# EAGLE design ESP_DCF77_Emulator (EAGLE 9.6.2)
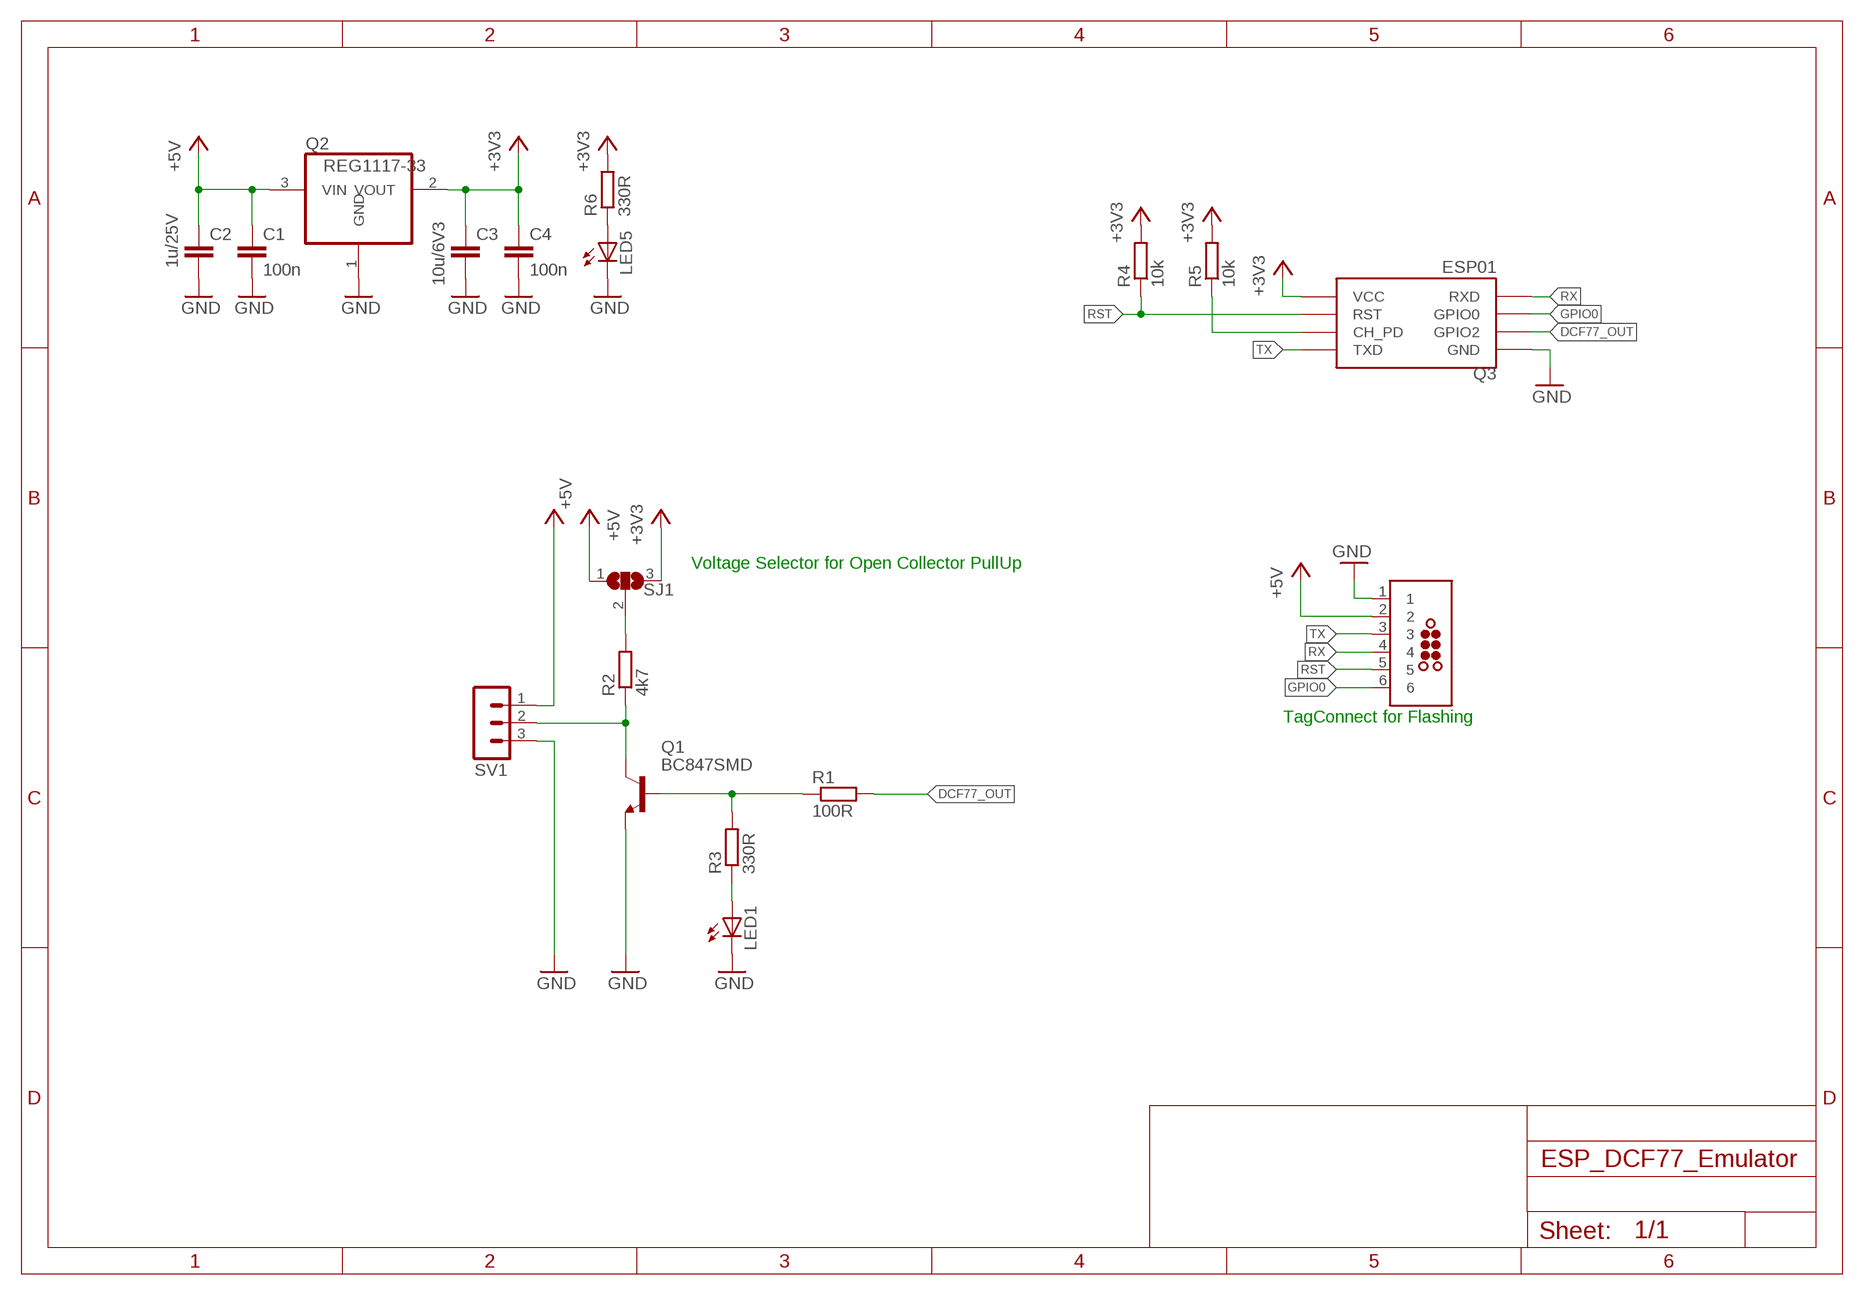
[diagram p0: schematic, sheet 1]

## Parts
C1  100n  C-EUC0603  [C0603]
C2  1u/25V  C-EUC0603  [C0603]
C3  10u/6V3  C-EUC0603  [C0603]
C4  100n  C-EUC0603  [C0603]
J6  TC2030-MCP-NL  [TC2030-MCP-NL]
LED1  LEDCHIP-LED0603  [CHIP-LED0603]
LED5  LEDCHIP-LED0603  [CHIP-LED0603]
Q1  BC847SMD  [SOT23]
Q2  REG1117-33  REG1117  [SOT223]
Q3  ESP01  [ESP01]
R1  100R  R-EU_R0603  [R0603]
R2  4k7  R-EU_R0603  [R0603]
R3  330R  R-EU_R0603  [R0603]
R4  10k  R-EU_R0603  [R0603]
R5  10k  R-EU_R0603  [R0603]
R6  330R  R-EU_R0603  [R0603]
SJ1  SJ2W  [SJ_2]
SV1  MA03-1  [MA03-1]

## Nets
+3V3: C3.1 C4.1 Q2.2(VOUT) Q3.VCC R4.2 R5.2 R6.2 SJ1.3
+5V: C1.1 C2.1 J6.2 Q2.3(VIN) SJ1.1 SV1.1
DCF77_OUT: Q3.GPIO2 R1.2
GND: C1.2 C2.2 C3.2 C4.2 J6.1 LED1.C LED5.C Q1.2(E) Q2.1(GND) Q3.GND SV1.3
GPIO0: J6.6 Q3.GPIO0
N$1: Q1.3(C) R2.1 SV1.2
N$2: Q1.1(B) R1.1 R3.2
N$3: R2.2 SJ1.2
N$4: LED1.A R3.1
N$7: Q3.CH_PD R5.1
N$13: LED5.A R6.1
RST: J6.5 Q3.RST R4.1
RX: J6.4 Q3.RX(RXD)
TX: J6.3 Q3.TX(TXD)

## Notes on the sheet
- Voltage Selector for Open Collector PullUp
- TagConnect for Flashing

## Library data of the parts
C1-C4 = rcl:C-EU: CAPACITOR, European symbol
J6 = tag-connect:TC2030: TAG-CONNECT ICSP Connector Manufacturer: Tag-Connect <http://www.tag-connect.com> Cable for easy In-Circuit Serial Programming. Designed for Microchip ICD2, suitable for many others. Two variants - one "with legs" (for hands-free fit on PCB) and another "without legs" for quick programming. PAD Description 1 MCLR/Vpp 2 Vdd 3 GND 4 PGD (ISPDAT) 5 PGC (ISPCLK) 6 nc (used for LVP) ©2009 ROFA.cz - modified and updated by Robert Darlington ‹rdarlington@gmail.com›
LED1 LED5 = led:LED: LED OSRAM: - CHIPLED LG R971, LG N971, LY N971, LG Q971, LY Q971, LO R971, LY R971 LH N974, LH R974 LS Q976, LO Q976, LY Q976 LO Q996 - Hyper CHIPLED LW Q18S LB Q993, LB Q99A, LB R99A - SideLED LS A670, LO A670, LY A670, LG A670, LP A670 LB A673, LV A673, LT A673, LW A673 LH A674 LY A675 LS A676, LA A676, LO A676, LY A676, LW A676 LS A679, LY A679, LG A679 - Hyper Micro SIDELED® LS Y876, LA Y876, LO Y876, LY Y876 LT Y87S - SmartLED LW L88C, LW L88S LB L89C, LB L89S, LG L890 LS L89K, LO L89K, LY L89K LS L896, LA L896, LO L896, LY L896 - TOPLED LS T670, LO T670, LY T670, LG T670, LP T670 LSG T670, LSP T670, LSY T670, LOP T670, LYG T670 LG T671, LOG T671, LSG T671 LB T673, LV T673, LT T673, LW T673 LH T674 LS T676, LA T676, LO T676, LY T676, LB T676, LH T676, LSB T676, LW T676 LB T67C, LV T67C, LT T67C, LS T67K, LO T67K, LY T67K, LW E67C LS E67B, LA E67B, LO E67B, LY E67B, LB E67C, LV E67C, LT E67C LW T67C LS T679, LY T679, LG T679 LS T770, LO T770, LY T770, LG T770, LP T770 LB T773, LV T773, LT T773, LW T773 LH T774 LS E675, LA E675, LY E675, LS T675 LS T776, LA T776, LO T776, LY T776, LB T776 LHGB T686 LT T68C, LB T68C - Hyper Mini TOPLED® LB M676 - Mini TOPLED Santana® LG M470 LS M47K, LO M47K, LY M47K Source: http://www.osram.convergy.de LUXEON: - LUMILED® LXK2-PW12-R00, LXK2-PW12-S00, LXK2-PW14-U00, LXK2-PW14-V00 LXK2-PM12-R00, LXK2-PM12-S00, LXK2-PM14-U00 LXK2-PE12-Q00, LXK2-PE12-R00, LXK2-PE12-S00, LXK2-PE14-T00, LXK2-PE14-U00 LXK2-PB12-K00, LXK2-PB12-L00, LXK2-PB12-M00, LXK2-PB14-N00, LXK2-PB14-P00, LXK2-PB14-Q00 LXK2-PR12-L00, LXK2-PR12-M00, LXK2-PR14-Q00, LXK2-PR14-R00 LXK2-PD12-Q00, LXK2-PD12-R00, LXK2-PD12-S00 LXK2-PH12-R00, LXK2-PH12-S00 LXK2-PL12-P00, LXK2-PL12-Q00, LXK2-PL12-R00 Source: www.luxeon.com KINGBRIGHT: KA-3528ASYC Source: www.kingbright.com
Q1 = transistor-npn:BC847*: NPN Transistor
Q2 = burr-brown:REG1117: 800mA and 1A Low Dropout (LDO) Positive Regulator 1.8V, 2.5V, 2.85V, 3.3V, 5V, and Adj; MPN: REG1117; OC_FARNELL: 1097566; OC_NEWARK: 14P6981
Q3 = esp8266modules:ESP01: ESP8266 Wifi module 01
R1-R6 = rcl:R-EU_: RESISTOR, European symbol
SJ1 = jumper:SJ2W: SMD solder JUMPER
SV1 = con-lstb:MA03-1: PIN HEADER; OC_FARNELL: unknown; OC_NEWARK: unknown

## Board
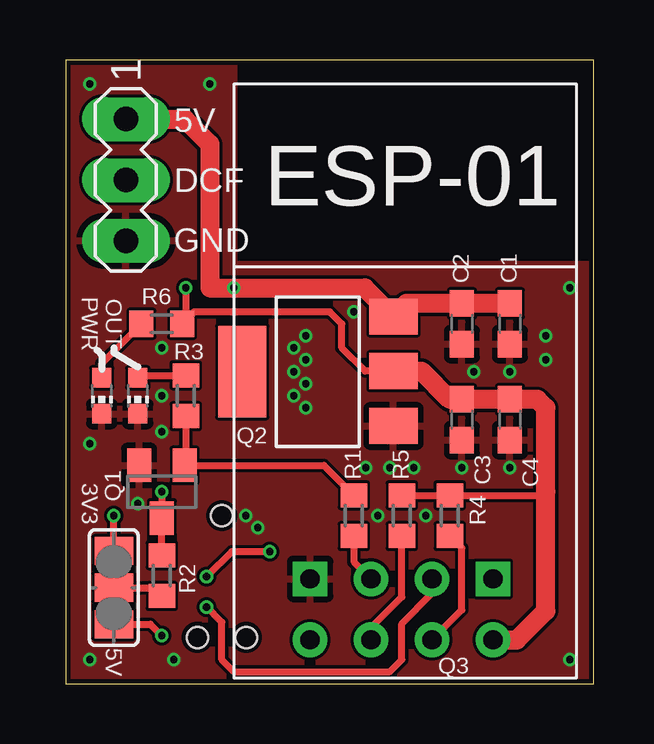
[diagram p1: board, top side]
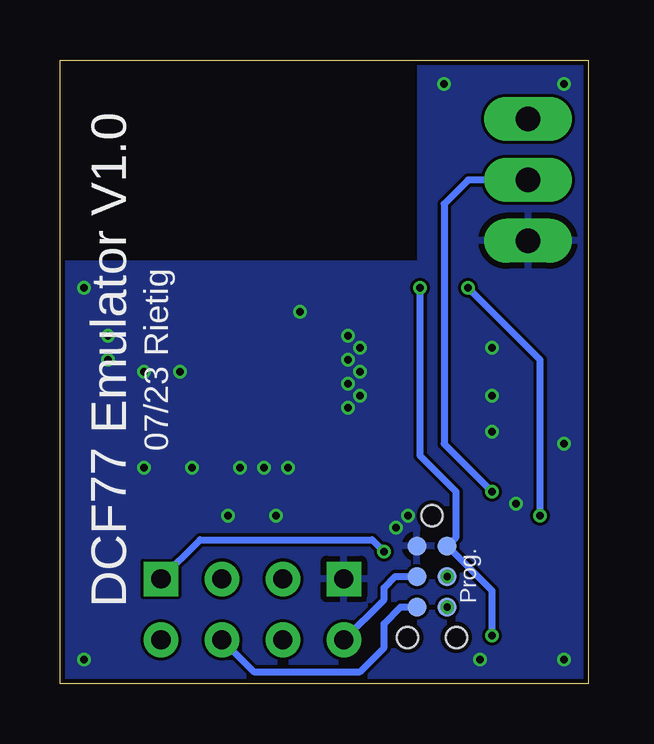
[diagram p2: board, bottom side, seen from below]

Size 22 x 26 mm. Coordinates in mm from the lower left corner, seen from the top.
Outline: 0,0 22,0 22,26 0,26 0,0
Copper layers (1*16): Top 0.035mm / dielectric 1.6mm / Bottom 0.035mm
Design rules "jlcpcb-2layers": minimum track width 0.2mm, minimum drill 0.3mm, track to track 5mil, track to pad 5mil, pad to pad 5mil, via to via 5mil, smd to smd 5mil, copper to edge 0.2mm, drill to drill 6mil, minimum pad ring 10mil, minimum via ring 0.125mm, stop-mask expansion 4mil, vias tented up to drill 0.5mm, thermal gap 10mil

### Footprints (pad centres in the part's own frame; a part is rotated, then mirrored left to right if it is on the bottom)
C0603 = smd 1.1 x 1: 1 -0.85,0; 2 0.85,0
TC2030-MCP-NL = smd 0.787 x 0.787: 1 1.27,-0.635; 2 1.27,0.635; 3 2.54,-0.635; 4 2.54,0.635; 5 3.81,-0.635; 6 3.81,0.635 | hole 0.889: 0,0; 5.08,-1.016; 5.08,1.016
CHIP-LED0603 = smd 0.8 x 0.8: A 0,-0.75; C 0,0.75
SOT23 = smd 1 x 1.4: 1 -0.95,-1.1; 2 0.95,-1.1; 3 0,1.1
SOT223 = smd 1.499 x 2.007: 1 -2.261,-3.15; 2 0.025,-3.15; 3 2.311,-3.15 | smd 3.81 x 2.007: 4 0,3.15
ESP01 = drill 0.8: CH_PD -1.285,-8.178; GPIO0 1.255,-5.638; GPIO2 -1.285,-5.638; RST 1.255,-8.178; TX -3.825,-8.178; VCC 3.795,-8.178 | drill 0.8 square: GND -3.825,-5.638; RX 3.795,-5.638
R0603 = smd 1 x 1.1: 1 -0.85,0; 2 0.85,0
SJ_2 = smd 1.168 x 1.6: 1 -1.524,0; 2 0,0; 3 1.524,0
MA03-1 = drill 1.016 long: 1 -2.54,0; 2 0,0; 3 2.54,0

### Placement (x,y rotation side)
C1  18.5,15 270 top
C2  16.5,15 270 top
C3  16.5,11 270 top
C4  18.5,11 270 top
J6  6.5,7 270 bottom
LED1  3,12 180 top
LED5  1.5,12 180 top
Q1  4,8 180 top
Q2  10.5,13 90 top
Q3  14,10 0 top
R1  12,7 270 top
R2  4,4.5 270 top
R3  5,12 270 top
R4  16,7 90 top
R5  14,7 90 top
R6  4,15 0 top
SJ1  2,4 90 top
SV1  2.5,21 270 top

### Tracks (layer width: path | path; a pad name or v marks a point on that pad's centre or on a via)
+3V3  (via drill 0.3)
  Top 0.3: R5.2 R4.2 19.85,7.85 20,8 | Q2.2 12.48,13.03 11.5,14 11.5,15 11,15.5 5.35,15.5 R6.2 5,15.15 v5,16.5 | SJ1.3 v2,7
  Top 0.8: Q3.VCC 18.8,1.82 20,3.03 20,8 20,11.5 19.65,11.85 C4.1 C3.1 16,11.85 14.82,13.03 Q2.2
  Bottom 0.3: v2,7 2,13.5 v5,16.5
+5V  (via drill 0.3)
  Top 0.3: SJ1.1 3.52,2.48 v4,2
  Top 0.8: SV1.1 4.96,23.54 6,22.5 6,16.5 v7,16.5 12.46,16.5 Q2.3 14.19,15.85 C2.1 C1.1
  Bottom 0.3: v4,2 4,3.87 J6.2 5.5,6.1 5.5,8 7,9.5 v7,16.5
DCF77_OUT
  Top 0.3: R1.2 12,5.08 Q3.GPIO2
GND  (via drill 0.3)
  other vias: 1,25 6,25 21,16.5 21,1 1,1 9.5,13 9.5,14 10,14.5 10,13.5 10,12.5 9.5,12 10,11.5 1,10 4,10.5 3,7.5 14.5,9 13.5,9 12.5,9 18.5,9 16.5,9 17,13 18.5,13 12,15.5 20,14.5 20,13.5 4.5,1 7.5,7 8,6.5 13,7 15,7 4,12 4,14
  pour Top: 0,26 7,26 7,17.5 22,17.5 21.96,0 0,0
  pour Bottom: 0,26 7,26 7,17.5 22,17.5 22,0 0,0
GPIO0  (via drill 0.3)
  Top 0.3: Q3.GPIO0 15.25,3.75 14,2.5 14,1 13.5,0.5 7,0.5 6.5,1 6.5,2.55 J6.6
  other vias: 5.86,3.19
N$1  (via drill 0.3)
  Top 0.3: R2.1 Q1.3 v4,8
  Bottom 0.3: SV1.2 5,21 6,20 6,10 v4,8
N$2
  Top 0.3: R3.2 5,9.15 Q1.1 10.75,9.1 R1.1
N$3
  Top 0.3: SJ1.2 3.65,4 R2.2
N$4
  Top 0.3: LED1.A 3.1,12.85 R3.1
N$7
  Top 0.3: Q3.CH_PD 12.71,2.32 14,3.61 R5.1
N$13
  Top 0.3: LED5.A 1.5,13.35 R6.1
RST
  Top 0.3: Q3.RST 16.5,3.07 16.5,5.65 R4.1
  Bottom 0.3: Q3.RST 13.93,0.5 9.5,0.5 8.5,1.5 8.5,2.5 7.81,3.19 J6.5
RX  (via drill 0.3)
  Top 0.3: v8.5,5.5 6.91,5.5 J6.4
  Bottom 0.3: Q3.RX 16.16,6 9,6 v8.5,5.5
  other vias: 5.86,4.46
TX
  Bottom 0.3: Q3.TX 8.5,3.5 8.5,4 8.04,4.46 J6.3

### Text on the board
tPlace: 5V | DCF | GND | PWR | OUT | 3V3 | 5V
bPlace: 07/23 Rietig | DCF77 Emulator V1.0
bNames: Prog.